# Altium schematic sheet camera.SchDoc: Camera Schematic
size A; DrawnBy: Mike Mozingo; Engineer: Mike Mozingo; Revision: 2; DocumentName: Camera Schematic
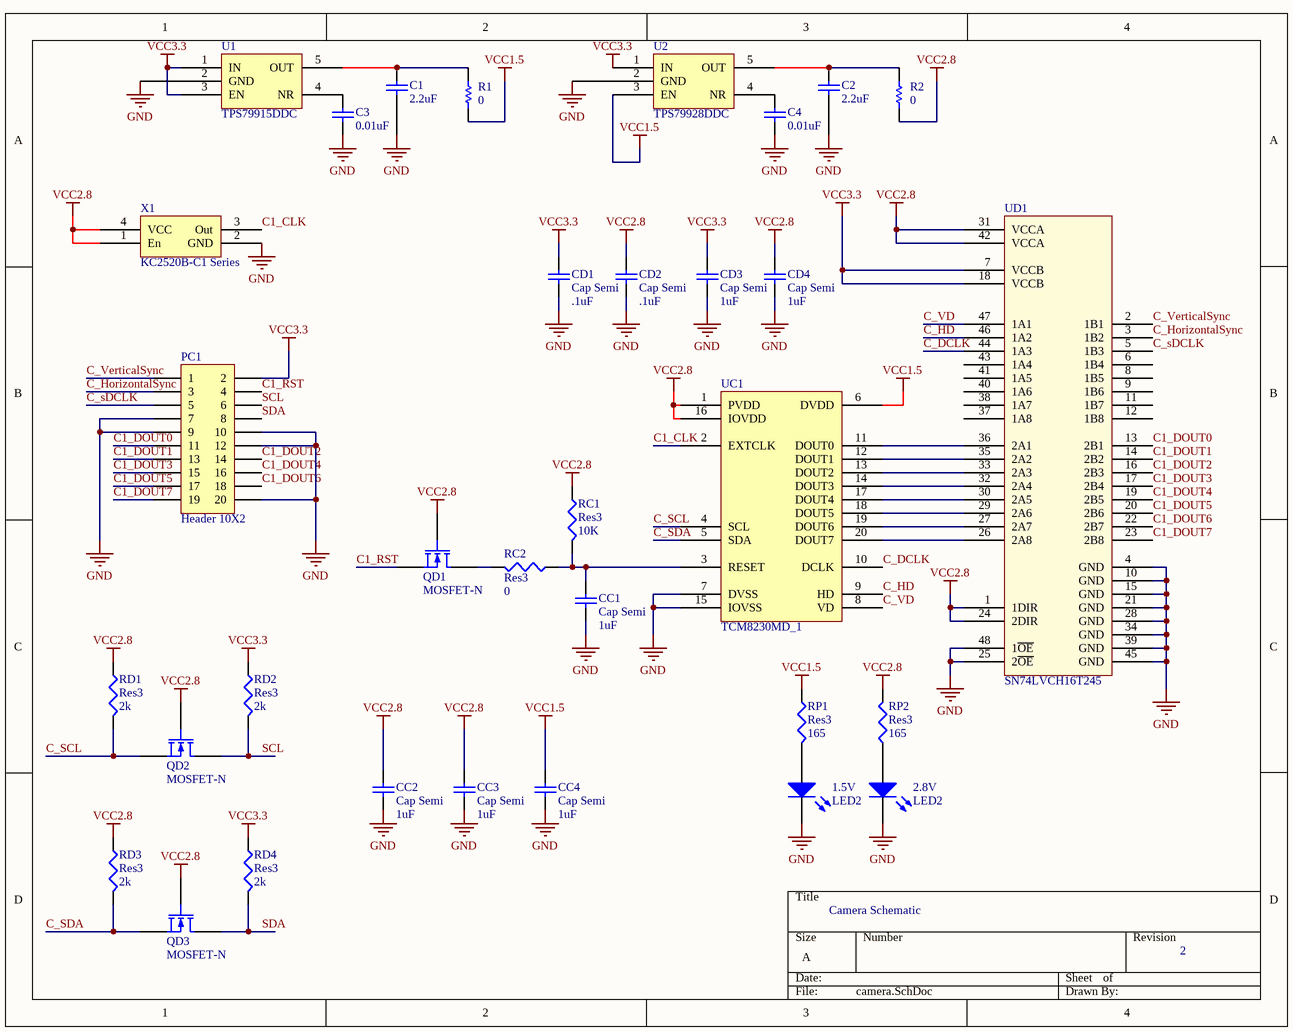
[diagram p0: camera.SchDoc]

## Parts
1.5V  LED2  [DIODE1608]
2.8V  LED2  [DIODE1608]
C1  value 2.2uF  [CAPC1608L]  (hidden comment: Cap Semi)
C2  value 2.2uF  [CAPC1608L]  (hidden comment: Cap Semi)
C3  value 0.01uF  [CAPC1608L]  (hidden comment: Cap Semi)
C4  value 0.01uF  [CAPC1608L]  (hidden comment: Cap Semi)
CC1  Cap Semi  value 1uF  [CAPC1608L]
CC2  Cap Semi  value 1uF  [CAPC1608L]
CC3  Cap Semi  value 1uF  [CAPC1608L]
CC4  Cap Semi  value 1uF  [CAPC1608L]
CD1  Cap Semi  value .1uF  [CAPC1608L]
CD2  Cap Semi  value .1uF  [CAPC1608L]
CD3  Cap Semi  value 1uF  [CAPC1608L]
CD4  Cap Semi  value 1uF  [CAPC1608L]
PC1  Header 10X2  [HDR2X10]
QD1  MOSFET-N  [SOT95P240-3N]
QD2  MOSFET-N  [SOT95P240-3N]
QD3  MOSFET-N  [SOT95P240-3N]
R1  value 0  [RESC1608L]  (hidden comment: Res Semi)
R2  value 0  [RESC1608L]  (hidden comment: Res Semi)
RC1  Res3  value 10K  [RESC1608L]
RC2  Res3  value 0  [RESC1608L]
RD1  Res3  value 2k  [RESC1608L]
RD2  Res3  value 2k  [RESC1608L]
RD3  Res3  value 2k  [RESC1608L]
RD4  Res3  value 2k  [RESC1608L]
RP1  Res3  value 165  [RESC1608L]
RP2  Res3  value 165  [RESC1608L]
U1  TPS79915DDC  [TSOT23-5]
U2  TPS79928DDC  [TSOT23-5]
UC1  TCM8230MD_1  [TCM8230MD]
UD1  SN74LVCH16T245  [SN74LVCH16T245]
X1  KC2520B-C1 Series  [KC2520B-C1]

## Nets
GND: 1.5V.2(K) 2.8V.2(K) C1.2 C2.2 C3.2 C4.2 CC1.1 CC2.1 CC3.1 CC4.1 CD1.1 CD2.1 CD3.1 CD4.1 PC1.7 PC1.9 PC1.10 PC1.12 PC1.20 U1.2(GND) U2.2(GND) UC1.7(DVSS) UC1.15(IOVSS) UD1.4(GND) UD1.10(GND) UD1.15(GND) UD1.21(GND) UD1.25(2~{OE}) UD1.28(GND) UD1.34(GND) UD1.39(GND) UD1.45(GND) UD1.48(1~{OE}) X1.2(GND)
VCC1.5: CC4.2 R1.2 RP1.1 U2.3(EN) UC1.6(DVDD)
VCC2.8: CC2.2 CC3.2 CD2.2 CD4.2 QD1.2(G) QD2.2(G) QD3.2(G) R2.2 RC1.2 RD1.1 RD3.1 RP2.2 UC1.1(PVDD) UC1.16(IOVDD) UD1.1(1DIR) UD1.24(2DIR) UD1.31(VCCA) UD1.42(VCCA) X1.1(En) X1.4(VCC)
VCC3.3: CD1.2 CD3.2 PC1.2 RD2.1 RD4.1 U1.1(IN) U1.3(EN) U2.1(IN) UD1.7(VCCB) UD1.18(VCCB)
C1_CLK: UC1.2(EXTCLK) X1.3(Out)
C1_DOUT0: PC1.11 UD1.13(2B1)
C1_DOUT1: PC1.13 UD1.14(2B2)
C1_DOUT2: PC1.14 UD1.16(2B3)
C1_DOUT3: PC1.15 UD1.17(2B4)
C1_DOUT4: PC1.16 UD1.19(2B5)
C1_DOUT5: PC1.17 UD1.20(2B6)
C1_DOUT6: PC1.18 UD1.22(2B7)
C1_DOUT7: PC1.19 UD1.23(2B8)
C1_RST: PC1.4 QD1.3(S)
C_DCLK: UC1.10(DCLK) UD1.44(1A3)
C_HD: UC1.9(HD) UD1.46(1A2)
C_HorizontalSync: PC1.3 UD1.3(1B2)
C_SCL: QD2.3(S) RD1.2 UC1.4(SCL)
C_SDA: QD3.3(S) RD3.2 UC1.5(SDA)
C_sDCLK: PC1.5 UD1.5(1B3)
C_VD: UC1.8(VD) UD1.47(1A1)
C_VerticalSync: PC1.1 UD1.2(1B1)
SCL: PC1.6 QD2.1(D) RD2.2
SDA: PC1.8 QD3.1(D) RD4.2
Net1.5V_1: 1.5V.1(A) RP1.2
Net2.8V_1: 2.8V.1(A) RP2.1
NetC1_1: C1.1 R1.1 U1.5(OUT)
NetC2_1: C2.1 R2.1 U2.5(OUT)
NetC3_1: C3.1 U1.4(NR)
NetC4_1: C4.1 U2.4(NR)
NetCC1_2: CC1.2 RC1.1 RC2.2 UC1.3(RESET)
NetQD1_1: QD1.1(D) RC2.1
NetUC1_11: UC1.11(DOUT0) UD1.36(2A1)
NetUC1_12: UC1.12(DOUT1) UD1.35(2A2)
NetUC1_13: UC1.13(DOUT2) UD1.33(2A3)
NetUC1_14: UC1.14(DOUT3) UD1.32(2A4)
NetUC1_17: UC1.17(DOUT4) UD1.30(2A5)
NetUC1_18: UC1.18(DOUT5) UD1.29(2A6)
NetUC1_19: UC1.19(DOUT6) UD1.27(2A7)
NetUC1_20: UC1.20(DOUT7) UD1.26(2A8)

Not connected (* = marked no-connect by the designer): UD1 6(1B4) 8(1B5) 9(1B6) 11(1B7) 12(1B8) 37(1A8) 38(1A7) 40(1A6) 41(1A5) 43(1A4)

## Library data of the parts
1.5V 2.8V = LED2: Typical RED, GREEN, YELLOW, AMBER GaAs LED; Published: 8-Jun-2000; LatestRevisionDate: 17-Jul-2002; LatestRevisionNote: Re-released for DXP Platform.; PackageVersion: Feb-2002; PackageReference: 3.2X1.6X1.1; Publisher: Altium Limited; Color: Blue
C1-C4 CC1-CC4 CD1-CD4 = Cap Semi: Capacitor (Semiconductor SIM Model); Published: 8-Jun-2000; LatestRevisionDate: 29-May-2009; LatestRevisionNote: IPC-7351 Footprint Added.; PackageReference: C1206; Publisher: Altium Limited; PackageDescription: Chip Capacitor
PC1 = Header 10X2: Header, 10-Pin, Dual row; LatestRevisionDate: 17-Jul-2002; LatestRevisionNote: Re-released for DXP Platform.; Publisher: Altium Limited
QD1-QD3 = MOSFET-N: N-Channel MOSFET; Published: 8-Jun-2000; LatestRevisionDate: 17-Jul-2002; LatestRevisionNote: Re-released for DXP Platform.; PackageVersion: 1995/1996; PackageReference: E3; Publisher: Altium Limited
R1 R2 = Res Semi: Semiconductor Resistor; Published: 8-Jun-2000; LatestRevisionDate: 17-Jul-2002; LatestRevisionNote: Re-released for DXP Platform.; PackageReference: AXIAL-0.5; Publisher: Altium Limited
RC1 RC2 RD1-RD4 RP1 RP2 = Res3: Resistor; Published: 8-Jun-2000; LatestRevisionDate: 29-May-2009; LatestRevisionNote: IPC-7351 Footprint Added.; PackageReference: J1-0603; Publisher: Altium Limited; PackageDescription: Chip Resistor
U1 U2 = TPS799xxDDC: 200mA, Low Quiescent Current, Ultra-Low Noise, High PSRR  Low Dropout Linear Regulator
UC1 = TCM8230MD_1: VGA CAMERA MODULE 640x480
UD1 = SN74LVCH16T245: 16-bit bus transceiver with voltage regulation.
X1 = KC2520B-C1: Standard Oscillator